# Altium project robotShield.PrjPcb
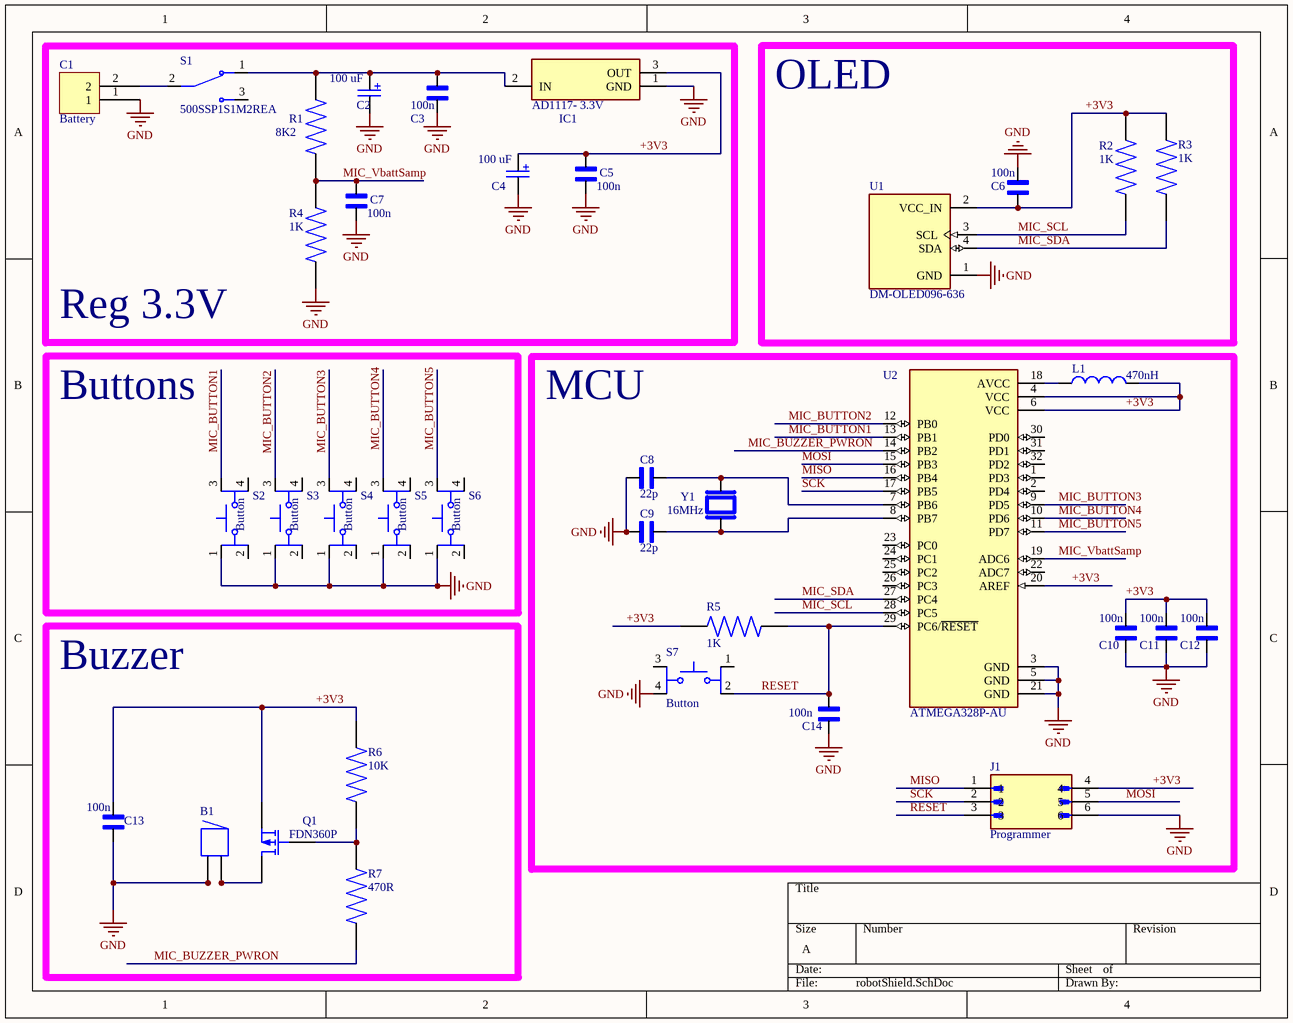
[diagram p0: robotShield.SchDoc]
1 sheet, 36 parts. Net scope: global (net labels, ports and power ports of the same name join across sheets).
Board file: robotShield.PcbDoc

## Sheet robotShield.SchDoc
size A; SheetNumber: 1; SheetTotal: 1

### Parts
B1  Buzzer3.3V  [Buzzer1]  (value not drawn)
C1  Battery  [Phonix2]
C2  value 100 uF  [Cap SMD Size A Tantalium]  (hidden comment: F930J107MAA)
C3  100n  [CAPC2012X135N]
C4  value 100 uF  [Cap SMD Size A Tantalium]  (hidden comment: F930J107MAA)
C5  100n  [CAPC2012X135N]
C6  100n  [CAPC2012X135N]
C7  100n  [CAPC2012X135N]
C8  22p  [CAPC2012X135N]
C9  22p  [CAPC2012X135N]
C10  100n  [CAPC2012X135N]
C11  100n  [CAPC2012X135N]
C12  100n  [CAPC2012X135N]
C13  100n  [CAPC2012X135N]
C14  100n  [CAPC2012X135N]
IC1  AD1117- 3.3V  [LD1086DT33TR]
J1  Programmer  [MOLEX_2068320602]
L1  470nH  [0805_WIDE]
Q1  FDN360P  [SOT-23_N]
R1  8K2  [RESC2012X60N]
R2  1K  [RESC2012X60N]
R3  1K  [RESC2012X60N]
R4  1K  [RESC2012X60N]
R5  1K  [RESC2012X60N]
R6  10K  [RESC2012X60N]
R7  470R  [RESC2012X60N]
S1  500SSP1S1M2REA  [SW_500SSP1S1M2REA]
S2  Button  [SW_TL6700AF160QG]
S3  Button  [SW_TL6700AF160QG]
S4  Button  [SW_TL6700AF160QG]
S5  Button  [SW_TL6700AF160QG]
S6  Button  [SW_TL6700AF160QG]
S7  Button  [SW_TL6700AF160QG]
U1  DM-OLED096-636  [MODULE_DM-OLED096-636]
U2  ATMEGA328P-AU  [QFP80P900X900X120-32N]
Y1  16MHz  [XTAL_ABLS7M2-25.000MHZ-D-2Y-T]

### Blocks framed on the sheet
Reg 3.3V: C1-C5 C7 IC1 R1 R4 S1
OLED: C6 R2 R3 U1
Buttons: S2-S6
MCU: C8-C12 C14 J1 L1 R5 S7 U2 Y1
Buzzer: B1 C13 Q1 R6 R7

### Nets
GND: B1.2 B1.2A C1.1 C2.2(-) C3.2 C4.2(-) C5.2 C6.1 C7.2 C8.1 C9.1 C10.2 C11.2 C12.2 C13.2 C14.2 IC1.1(GND) J1.6 R4.1 S2.1 S3.1 S4.1 S5.1 S6.1 S7.4 U1.1(GND) U2.3(GND) U2.5(GND) U2.21(GND)
+3V3: C4.1(+) C5.1 C6.2 C10.1 C11.1 C12.1 C13.1 IC1.3(OUT) J1.4 L1.2 Q1.2(S) R2.1 R3.2 R5.1 R6.2 U1.2(VCC_IN) U2.4(VCC) U2.6(VCC) U2.20(AREF)
MIC_BUTTON1: S2.3 U2.13(PB1)
MIC_BUTTON2: S3.3 U2.12(PB0)
MIC_BUTTON3: S4.3 U2.9(PD5)
MIC_BUTTON4: S5.3 U2.10(PD6)
MIC_BUTTON5: S6.3 U2.11(PD7)
MIC_BUZZER_PWRON: R7.1 U2.14(PB2)
MIC_SCL: R2.2 U1.3(SCL) U2.28(PC5)
MIC_SDA: R3.1 U1.4(SDA) U2.27(PC4)
MIC_VbattSamp: C7.1 R1.1 R4.2 U2.19(ADC6)
MISO: J1.1 U2.16(PB4)
MOSI: J1.5 U2.15(PB3)
RESET: C14.1 J1.3 R5.2 S7.2 U2.29(PC6/~{RESET})
SCK: J1.2 U2.17(PB5)
NetB1_1: B1.1 B1.1A Q1.3(D)
NetC1_2: C1.2 S1.2(COM)
NetC2_1: C2.1(+) C3.1 IC1.2(IN) R1.2 S1.1(NC)
NetC8_2: C8.2 U2.7(PB6) Y1.2
NetC9_2: C9.2 U2.8(PB7) Y1.1
NetL1_1: L1.1 U2.18(AVCC)
NetQ1_1: Q1.1(G) R6.1 R7.2

Not connected (* = marked no-connect by the designer): S1 3(NO); S2 2 4; S3 2 4; S4 2 4; S5 2 4; S6 2 4; S7 1 3; U2 1(PD3) 2(PD4) 22(ADC7) 23(PC0) 24(PC1) 25(PC2) 26(PC3) 30(PD0) 31(PD1) 32(PD2)

### Library data of the parts
B1 = Buzzer: Buzzer 5V; pin to pad: 1A>1 2A>2; Sup1: Javan; Published: 24-Mar-1999; LatestRevisionDate: 17-Dec-2003; LatestRevisionNote: Schematic revised, PCB Footprint replaced.; DatasheetVersion: 17-Dec-2003; PackageReference: ABSM-1574; Publisher: Altium Limited; PackageDescription: Magnetic Transducer Buzzer; ComponentLink1Description: Manufacturer Link; ComponentLink1URL: http://www.megastar.com/linecard/buzzmode/index.php; UnitPrice: 5250
C1 = Phonix2
C2 C4 = Capacitor: CAP TANT 100UF 6.3V 20% 1206; Link: https://www.digikey.com/products/en/capacitors/tantalum-capacitors/59?k=CAP+TANT+100U&k=&pkeyword=CAP+TANT+100U&pv13=67&pv987=1&FV=ffe0003b&mnonly=0&newproducts=0&ColumnSort=0&page=1&quantity=0&ptm=0&fid=0&pageSize=25; Price: 0.18
C3 C5-C14 = GRM21BR61A106KE19K: SMD Capacitor X5R(EIA) with Capacitance: 10uF Tol. 10%. Rated Voltage: 10Vdc; MF: Murata; SnapEDA_Link: https://www.snapeda.com/parts/GRM21BR61A106KE19K/Murata+Electronics+North+America/view-part/?ref=snap; Package: 0805 Murata; Value: *; MP: GRM21BR61A106KE19K; Check_prices: https://www.snapeda.com/parts/GRM21BR61A106KE19K/Murata+Electronics+North+America/view-part/?ref=eda
IC1 = LD1086DT33TR: Linear Voltage Regulator IC Positive Fixed 1 Output 1.5A DPAK; MF: STMicroelectronics; SnapEDA_Link: https://www.snapeda.com/parts/LD1086DT33TR/STMicroelectronics/view-part/?ref=snap; Package: TO-252 STMicroelectronics; Value: *; MP: LD1086DT33TR; Check_prices: https://www.snapeda.com/parts/LD1086DT33TR/STMicroelectronics/view-part/?ref=eda
J1 = 2068320602: Value: *; Package: None; Price: None; Availability: Unavailable; MP: 2068320602
L1 = Self
Q1 = MOSFET-P: P-Channel MOSFET; Published: 8-Jun-2000; LatestRevisionDate: 17-Jul-2002; LatestRevisionNote: Re-released for DXP Platform.; PackageVersion: 1995/1996; PackageReference: E3; Publisher: Altium Limited; PackageDescription: TO, Flat Index; 3 In-Line, Axial Leads; Body Dia. 4.6mm; Lead Dia. 0.5 mm (max)
R1-R7 = RC0805FR-07910RL: 910 Ohms Â±1% 0.125W, 1/8W Chip Resistor 0805 (2012 Metric) Moisture Resistant Thick Film; MF: Yageo; Package: 2012 Rohm Semiconductor; Value: *; Purchase-URL: https://pricing.snapeda.com/search/part/RC0805FR-07910RL/?ref=eda; Availability: In Stock; MP: RC0805FR-07910RL; Price: None
S1 = 500SSP1S1M2REA: Slide Switch SPDT Through Hole  <a href="https://pricing.snapeda.com/parts/500SSP1S1M2REA/E-Switch/view-part?ref=eda">Check availability</a> <a href="https://pricing.snapeda.com/parts/500SSP1S1M2REA/E-Switch/view-part?ref=eda">Check availability</a>; Value: *; MP: 500SSP1S1M2REA; Availability: Unavailable; Package: None; Price: None
S2-S7 = TL6700AF160QG: Value: *; Package: None; Price: None; MP: TL6700AF160QG; Availability: Unavailable
U1 = DM-OLED096-636: 0.96â€ 128 X 64 MONOCHROME GRAPHIC OLED DISPLAY MODULE - I2C; SnapEDA_Link: https://www.snapeda.com/parts/DM-OLED096-636/Display+Module/view-part/?ref=snap; Package: Package; Value: *; MF: Display Module; MP: DM-OLED096-636; Check_prices: https://www.snapeda.com/parts/DM-OLED096-636/Display+Module/view-part/?ref=eda
U2 = ATMEGA328P-AU: AVR AVRÂ® ATmega Microcontroller IC 8-Bit 20MHz 32KB (16K x 16) FLASH 32-TQFP (7x7); MF: Microchip Technology; SnapEDA_Link: https://www.snapeda.com/parts/ATMEGA328P-AU/Microchip/view-part/?ref=snap; Package: TQFP-32 Microchip; Value: *; MP: ATMEGA328P-AU; Check_prices: https://www.snapeda.com/parts/ATMEGA328P-AU/Microchip/view-part/?ref=eda
Y1 = ABLS7M2-25.000MHZ-D-2Y-T: 25 MHz Â±20ppm Crystal 18pF 60 Ohms 2-SMD, Flat Lead; MF: Abracon LLC; SnapEDA_Link: https://www.snapeda.com/parts/ABLS7M2-25.000MHZ-D-2Y-T/Abracon+LLC/view-part/?ref=snap; Package: Package; Value: *; MP: ABLS7M2-25.000MHZ-D-2Y-T; Check_prices: https://www.snapeda.com/parts/ABLS7M2-25.000MHZ-D-2Y-T/Abracon+LLC/view-part/?ref=eda